# EasyEDA Pro project SCH.epro

# Schematic SCH_1
Board Name: Board1_1; Create Date: 2024-10-25; Page Name: P1; Project Name: 模拟试题; Schematic Name: SCH_1; Update Date: 2024-10-25; Company: 嘉立创EDA; Page Size: A4; Version: V1.0
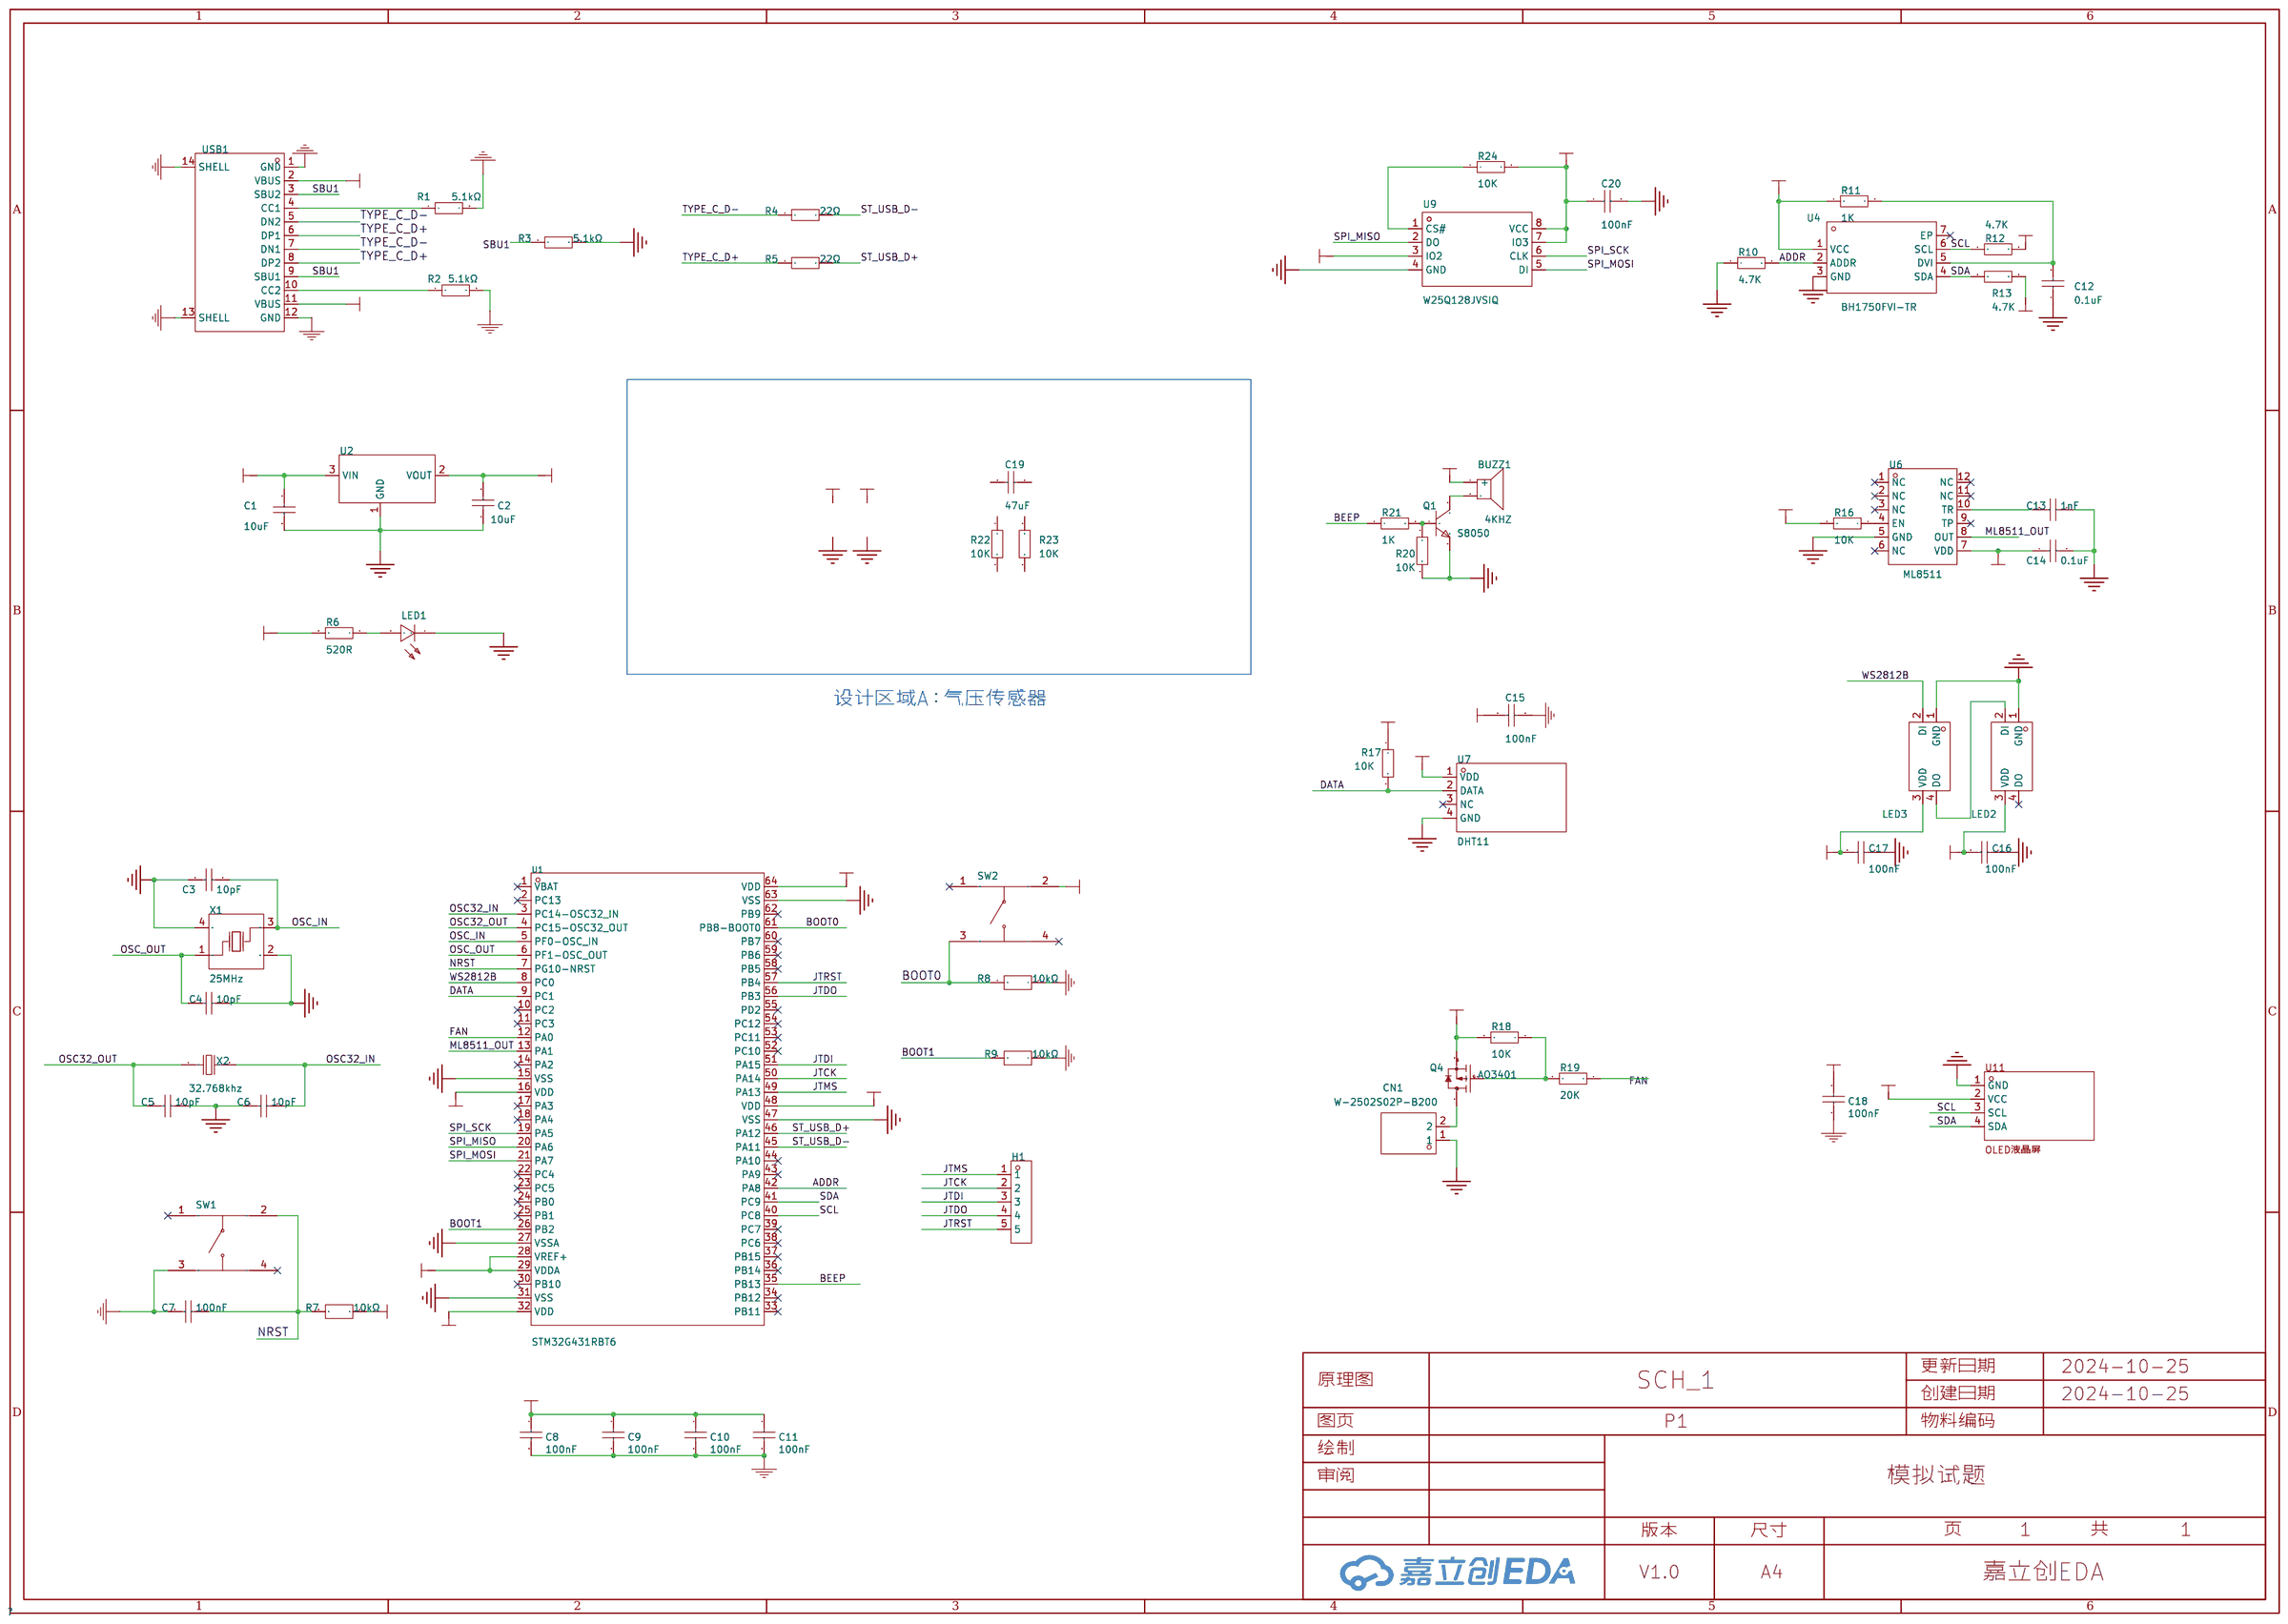
[diagram p0: schematic sheet]

## Parts
BUZZ1  4KHZ  [BUZ-TH_BD12.0-P7.60-D0.6-FD]
C1  10uF  [C0805]
C2  10uF  [C0805]
C3  10pF  [C0805]
C4  10pF  [C0805]
C5  10pF  [C0805]
C6  10pF  [C0805]
C7  100nF  [C0603]
C8  100nF  [C0603]
C9  100nF  [C0603]
C10  100nF  [C0603]
C11  100nF  [C0603]
C12  0.1uF  [C0805]
C13  1nF  [C0805]
C14  0.1uF  [C0805]
C15  100nF  [C0603]
C16  100nF  [C0805]
C17  100nF  [C0805]
C18  100nF  [C0603]
C19  47uF  [C0805]
C20  100nF  [C0603]
CN1  W-2502S02P-B200  [CONN-TH_2P-P2.54_2501S-2P]
H1  -  [5P排针]
LED1  NCD0603R1  [LED0603-RD_RED]
LED2  XL-5050RGBC-WS2812B  [LED-SMD_4P-L5.0-W5.0-BL_XL-5050RGBC]
LED3  XL-5050RGBC-WS2812B  [LED-SMD_4P-L5.0-W5.0-BL_XL-5050RGBC]
Q1  S8050  [SOT-23-3_L2.9-W1.3-P1.90-LS2.3-BR]
Q4  AO3401  [SOT-23-3_L2.9-W1.3-P1.90-LS2.4-BR]
R1  5.1kΩ  [R0603]
R2  5.1kΩ  [R0603]
R3  5.1kΩ  [R0603]
R4  22Ω  [R0603]
R5  22Ω  [R0603]
R6  520R  [R0402]
R7  10kΩ  [R0603]
R8  10kΩ  [R0603]
R9  10kΩ  [R0603]
R10  4.7K  [R0805]
R11  1K  [R0805]
R12  4.7K  [R0805]
R13  4.7K  [R0805]
R16  10K  [R0402]
R17  10K  [R0805]
R18  10K  [R0603]
R19  20K  [R0603]
R20  10K  [R0805]
R21  1K  [R0805]
R22  10K  [R0805]
R23  10K  [R0805]
R24  10K  [R0805]
SW1  TSA017A2540A07  [SW-SMD_4P-L4.2-W3.4-P2.15-LS5.2]
SW2  TSA017A2540A07  [SW-SMD_4P-L4.2-W3.4-P2.15-LS5.2]
U1  STM32G431RBT6  [LQFP-64_L10.0-W10.0-P0.50-LS12.0-BL]
U2  AMS1117-3.3(XBLW)  [SOT-223-3_L6.5-W3.4-P2.30-LS7.0-BR-1]
U4  BH1750FVI-TR  [WSOF-6_L2.6-W1.6-P0.50-TL-EP]
U6  ML8511  [DFN-12_L4.0-W3.7-P1.00-TL]
U7  DHT11  [SENSOR-TH_DHT11]
U8  -  [CONN-TH_4P-P2.54_POGO-4P]
U9  W25Q128JVSIQ  [SOIC-8_L5.3-W5.3-P1.27-LS8.0-BL]
USB1  TYPE-C 16PIN 2MD(073)  [USB-C-SMD_TYPE-C-6PIN-2MD-073]
X1  25MHz  [OSC-SMD_4P-L3.2-W2.5-BL]
X2  32.768kHz  [FC-135R_L3.2-W1.5]

## Library data of the parts
BUZZ1 = TMB12A05_C96093: 驱动方式:有源(内含驱动线路);构造类型:电磁式;频率:2.7kHz;声压(SPL):85dB;; LCSC Part Name: TMB12A05; Supplier Part: C96093; Manufacturer: 华能; Manufacturer Part: TMB12A05; Supplier Footprint: 插件,D=12mm; JLCPCB Part Class: Extended Part; Datasheet: https://atta.szlcsc.com/upload/public/pdf/source/20230426/A4FC10532558AA232D532AB83455FBA4.pdf; Supplier: LCSC; Oscillator Circuit: 有源(内含驱动线路); Technology Type: 电磁式; Operating Voltage: 4V~8V; Sound Pressure Level (SPL): 85dB; Diameter (φD): 12mm; Height: 9.8mm
C1-C6 C12-C14 C16 C17 C19 = CC0805KRX7R9BB104: 容值:100nF;精度:±10%;额定电压:50V;材质(温度系数):X7R;; LCSC Part Name: 100nF ±10% 50V; Supplier Part: C49678; Manufacturer: YAGEO(国巨); Supplier Footprint: 0805; JLCPCB Part Class: 基础库; Datasheet: https://atta.szlcsc.com/upload/public/pdf/source/20180224/C181747_15194369449651363981.pdf; Supplier: LCSC; Tolerance: ±10%; Voltage Rated: 50V; Temperature Coefficient: X7R
C7-C11 C15 C18 C20 = CC0603KRX7R9BB104: 容值:100nF;精度:±10%;额定电压:50V;材质(温度系数):X7R;; LCSC Part Name: 100nF ±10% 50V; Supplier Part: C14663; Manufacturer: YAGEO(国巨); Supplier Footprint: 0603; JLCPCB Part Class: Basic Part; Datasheet: https://atta.szlcsc.com/upload/public/pdf/source/20180910/C282072_33301C7F631E79921B82A8DAC6BCC5B3.pdf; Supplier: LCSC; Tolerance: ±10%; Voltage Rated: 50V; Temperature Coefficient: X7R
CN1 = W-2502S02P-B200: 插针结构:1x2P;间距:2.5mm;安装方式:-;参考系列:XH;总PIN数:2P;排数:1;每排PIN数:2;行距:-;触头材质:黄铜;; LCSC Part Name: 系列:XH 间距:2.5mm 1x2P; Supplier Part: C132463; Manufacturer: Ckmtw(灿科盟); Supplier Footprint: 插件,P=2.5mm; JLCPCB Part Class: Extended Part; Datasheet: https://atta.szlcsc.com/upload/public/pdf/source/20180112/C169006_15157258886881261764.pdf; Supplier: LCSC; Pins Structure: 1x2P; Pitch: 2.5mm; Reference Series: XH; Number of Pins: 2P; Number of Rows: 1; Number of PINs Per Row: 2; Contact Material: 黄铜
H1 = 5P排针: Supplier: LCSC; Supplier Part: C168673; Manufacturer: Amphenol ICC; Manufacturer Part: 68000-102HLF; _: 3
LED1 = NCD0603R1_C84263: 灯头类型:-;发光颜色:红色;正向电压(VF):1.6V~2.6V;功率:65mW;正向电流:20mA;主波长:615nm~630nm;二极管配置:独立二极管;透镜颜色:无色透明透镜;色温:-;发光强度:80mcd~220mcd;发光角度:130°;载带方式:-;工作温度:-30℃~+85℃;; Supplier Part: C84263; Manufacturer: 国星光电; Supplier Footprint: 0603; JLCPCB Part Class: Extended Part; Datasheet: https://atta.szlcsc.com/upload/public/pdf/source/20200820/C84263_DABC6A75E58F576973B407FDBA283D60.pdf; Supplier: LCSC; Emitted Color: 红色; Forward Voltage (VF): 1.6V~2.6V; Power Dissipation: 65mW; Forward Current: 20mA; Dominant Wavelength: 615nm~630nm; Diode Configuration: 独立二极管; Lens Color: 无色透明透镜; Luminous Intensity: 80mcd~220mcd; Viewing Angle: 130°; Operating Temperature: -30℃~+85℃
LED2 LED3 = XL-5050RGBC-WS2812B: 5050七彩幻彩透明贴片LED灯珠 5050 幻彩透明四脚 ws2812B 内置驱动IC; Supplier Part: C2843785; Manufacturer: XINGLIGHT(成兴光); Supplier Footprint: SMD5050; JLCPCB Part Class: Extended Part; Datasheet: https://atta.szlcsc.com/upload/public/pdf/source/20240412/E1004CAA80592E31D08BFE019083806F.pdf; Supplier: LCSC; Emitted Color: RGB三色; Diode Configuration: 共阳极; Dominant Wavelength: 618nm~623nm；520nm~525nm；467nm~472nm; Peak Wavelength: 525nm；623nm；472nm; Forward Current: 20mA; Forward Voltage (VF): 3.4V；3.4V；2.4V; Luminous Intensity: 143mcd；240mcd；845mcd; Power Dissipation: 50mW；50mW；45mW; Viewing Angle: 120°; Mounting Sytle: 正贴; Operating Temperature: -25℃~+80℃
Q1 = S8050_C20069125: 晶体管类型:NPN;集电极电流(Ic):500mA;集射极击穿电压(Vceo):25V;功率(Pd):300mW;直流电流增益(hFE@Ic,Vce):120@50mA,1.0V;; LCSC Part Name: NPN 电流:500mA 耐压:25V; Supplier Part: C20069125; Manufacturer: 宏迦橙; Supplier Footprint: SOT-23; JLCPCB Part Class: Extended Part; Datasheet: https://atta.szlcsc.com/upload/public/pdf/source/20240403/2D78449C96B6E27F13BF8BDF79E27159.pdf; Supplier: LCSC; Transistor Type: NPN; Collector Current (Ic): 500mA; Collector-Emitter Breakdown Voltage (Vceo): 25V; Power Dissipation (Pd): 300mW; DC Current Gain (hFE@Ic,Vce): 120@50mA,1.0V; Transition Frequency (fT): 100MHz; Collector Cut-Off Current (Icbo): 100nA; Collector-Emitter Saturation Voltage (VCE(sat)@Ic,Ib): 600mV@500mA,50mA; Operating Temperature: -55℃~+150℃
Q4 = AO3401_C181091: 类型:1个P沟道;漏源电压(Vdss):30V;连续漏极电流(Id):4.2A;功率(Pd):350mW;导通电阻(RDS(on)@Vgs,Id):65mΩ@10V,4.2A;阈值电压(Vgs(th)@Id):1.3V@250uA;; LCSC Part Name: 1个P沟道 耐压:30V 电流:4.2A; Supplier Part: C181091; Manufacturer: Hottech(合科泰); Supplier Footprint: SOT-23; JLCPCB Part Class: 扩展库; Datasheet: https://atta.szlcsc.com/upload/public/pdf/source/20180131/C181091_15173931948391329220.pdf; Supplier: LCSC; Type: 1个P沟道; Drain Source Voltage (Vdss): 30V; Continuous Drain Current (Id): 4.2A; Power Dissipation (Pd): 350mW; Drain Source On Resistance (RDS(on)@Vgs,Id): 65mΩ@10V,4.2A; Gate Threshold Voltage (Vgs(th)@Id): 1.3V@250uA
R1-R3 = 0603WAF5101T5E: 电阻类型:厚膜电阻;阻值:5.1kΩ;精度:±1%;功率:100mW;最大工作电压:75V;温度系数:±100ppm/℃;; LCSC Part Name: 5.1kΩ ±1% 100mW 厚膜电阻; Supplier Part: C23186; Manufacturer: UNI-ROYAL(厚声); Supplier Footprint: 0603; JLCPCB Part Class: Basic Part; Datasheet: https://atta.szlcsc.com/upload/public/pdf/source/20200306/C422600_1E6D84923E4A46A82E41ADD87F860B5C.pdf; Supplier: LCSC; Type: 厚膜电阻; Tolerance: ±1%; Power(Watts): 100mW; Overload Voltage (Max): 75V; Temperature Coefficient: ±100ppm/℃; Operating Temperature Range: -55℃~+155℃
R4 R5 = 0603WAF220JT5E: 电阻类型:厚膜电阻;阻值:22Ω;精度:±1%;功率:100mW;最大工作电压:75V;温度系数:±100ppm/℃;; LCSC Part Name: 22Ω ±1% 100mW 厚膜电阻; Supplier Part: C23345; Manufacturer: UNI-ROYAL(厚声); Supplier Footprint: 0603; JLCPCB Part Class: Basic Part; Datasheet: https://atta.szlcsc.com/upload/public/pdf/source/20200306/C422600_1E6D84923E4A46A82E41ADD87F860B5C.pdf; Supplier: LCSC; Type: 厚膜电阻; Tolerance: ±1%; Power(Watts): 100mW; Overload Voltage (Max): 75V; Temperature Coefficient: ±100ppm/℃; Operating Temperature Range: -55℃~+155℃
R6 R16 = RC0402FR-0710KL: 电阻类型:厚膜电阻;阻值:10kΩ;精度:±1%;功率:62.5mW;; LCSC Part Name: 10kΩ ±1% 62.5mW; Supplier Part: C60490; Manufacturer: YAGEO(国巨); Supplier Footprint: 0402; JLCPCB Part Class: Extended Part; Datasheet: https://atta.szlcsc.com/upload/public/pdf/source/20170606/1496716515432.pdf; Supplier: LCSC; Type: 厚膜电阻; Tolerance: ±1%; Power(Watts): 62.5mW; Temperature Coefficient: ±100ppm/℃; Overload Voltage (Max): 50V; Operating Temperature Range: -55℃~+155℃
R7-R9 = 0603WAF1002T5E: 电阻类型:厚膜电阻;阻值:10kΩ;精度:±1%;功率:100mW;最大工作电压:75V;温度系数:±100ppm/℃;; LCSC Part Name: 厚膜电阻 10kΩ ±1% 100mW; Supplier Part: C25804; Manufacturer: UNI-ROYAL(厚声); Supplier Footprint: 0603; JLCPCB Part Class: Basic Part; Datasheet: https://atta.szlcsc.com/upload/public/pdf/source/20200306/C422600_1E6D84923E4A46A82E41ADD87F860B5C.pdf; Supplier: LCSC; Type: 厚膜电阻; Tolerance: ±1%; Power(Watts): 100mW; Overload Voltage (Max): 75V; Temperature Coefficient: ±100ppm/℃; Operating Temperature Range: -55℃~+155℃
R10-R13 R17 R20-R24 = Res_0805: Supplier Footprint: 0805
R18 R19 = Res_0603: Supplier Footprint: 0603
SW1 SW2 = TSA017A2540A07: 按钮形状:椭圆形按钮;作用力:400gf;安装方式:立贴;开关长度:4.2mm;开关宽度:3.35mm;开关高度:2.5mm;触点电流:50mA;额定电压(AC):-;额定电压(DC):12V;机械寿命:-;; LCSC Part Name: 4.2*3.35*2.5mm 立贴 轻触开关; Supplier Part: C2888434; Manufacturer: BZCN(博众电气); Supplier Footprint: SMD; JLCPCB Part Class: 扩展库; Datasheet: https://atta.szlcsc.com/upload/public/pdf/source/20210906/F29F74F1A6DE5E6C38338EAD973C3529.pdf; Supplier: LCSC; Actuator Style: 椭圆形按钮; Operating Force: 400gf; Mounting Style: 立贴; Switch Length: 4.2mm; Switch Width: 3.35mm; Switch Height: 2.5mm; Contact Current: 50mA; Voltage Rating (DC): 12V; Actuator/Cap Color: 白色
U1 = STM32G431RBT6: CPU内核:ARM-M系列;程序存储容量:128KB;GPIO端口数量:52;工作电压范围:1.71V~3.6V;CPU最大主频:170MHz;; Supplier Part: C431633; Manufacturer: ST(意法半导体); Supplier Footprint: LQFP-64(10x10); JLCPCB Part Class: 扩展库; Datasheet: https://atta.szlcsc.com/upload/public/pdf/source/20190925/C431633_8068E60CC825A086DCCD86A4BDED9458.pdf; Supplier: LCSC; CPU Core: ARM-M系列; Program Storage Size: 128KB; GPIO Ports Number: 52; Operating Voltage Range: 1.71V~3.6V; CPU Maximum Speed: 170MHz; Operating Temperature Range: -40℃~+85℃; ADC (Bit): 12bit; DAC (Bit): 12bit; Watchdog: 有; Infrared Data Association: 有; Low-Voltage Detect: 有; Direct Memory Access: 有; Internal Oscillator: 有
U2 = AMS1117-3.3(XBLW)_C18906017: 最大输入电压:15V;输出电压:3.3V;最大输出电流:1A;电源纹波抑制比(PSRR):60dB;; Supplier Part: C18906017; Manufacturer: XBLW(芯伯乐); Supplier Footprint: SOT-223; JLCPCB Part Class: 扩展库; Datasheet: https://atta.szlcsc.com/upload/public/pdf/source/20231019/F4230EEFC48908FC91962BB59ACA9AD6.pdf; Supplier: LCSC; Maximum Input Voltage: 15V; Output Voltage: 3.3V; MAX Output Current: 1A; Power Supply Rejection Ratio (PSRR): 60dB; standby current: 4mA; Operating Temperature: -40℃~+125℃; Number of Outputs: 1
U4 = BH1750FVI-TR: 检测颜色:-;接口类型:I2C;分辨率(位):16;; Supplier Part: C78960; Manufacturer: ROHM(罗姆); Supplier Footprint: WSOF-6; Datasheet: https://atta.szlcsc.com/upload/public/pdf/source/20160723/1469258984787.pdf; Supplier: LCSC; Interface Type: I2C; Supply Voltage: 2.4V~3.6V; Resolution: 16; Operating Temperature: -40℃~+85℃
U6 = ML8511_REFBOARD: Supplier Part: C19501581; Manufacturer: ROHM(罗姆); JLCPCB Part Class: 扩展库; Datasheet: https://atta.szlcsc.com/upload/public/pdf/source/20231221/86F2DBEAA739866045DC95770D30AEE3.pdf; Supplier: LCSC
U7 = DHT11: 新款电容式数字温湿度传感器,老款已停产16.1x12.6x5.8mm; Supplier: LCSC; Supplier Part: C117051; Manufacturer: 广州奥松; LCSC Part Name: DHT11  电容式传感器; Supplier Footprint: SIP-4; Datasheet: https://atta.szlcsc.com/upload/public/pdf/source/20170703/1499081238365.pdf
U8 = OLED液晶屏
U9 = W25Q128JVSIQ: 存储器构架(格式):FLASH;存储器接口类型:SPI - Dual/Quad I/O;存储器容量:128Mb (16M x 8);; Supplier Part: C97521; Manufacturer: WINBOND(华邦); Supplier Footprint: SOIC-8_208mil; JLCPCB Part Class: Basic Part; Datasheet: https://atta.szlcsc.com/upload/public/pdf/source/20170316/1489627409956.pdf; Supplier: LCSC; Memory Format: FLASH; Memory Interface: SPI - Dual/Quad I/O; Memory Size: 128Mb (16M x 8); Voltage - Supply: 2.7V ~ 3.6V
USB1 = TYPE-C 16PIN 2MD(073): 连接器类型:Type-C;标准:-;公母:母;端口数量:1;触点数量:16P;安装方式:卧贴;额定电流 - 电源:5A;工作温度范围:-25℃~+85℃;; LCSC Part Name: Type-C 母 卧贴; Supplier Part: C2765186; Manufacturer: SHOU HAN(首韩); Supplier Footprint: SMD; JLCPCB Part Class: Extended Part; Datasheet: https://atta.szlcsc.com/upload/public/pdf/source/20211123/39B17C16241EAC15C5E277BDA434118E.pdf; Supplier: LCSC; Connector Type: Type-C; Gender: 母; Number of Ports: 1; Number of Contacts: 16P; Mounting Style: 卧贴; Current Rating - Power (Max): 5A; Operating Temperature Range: -25℃~+85℃
X1 = X322525MOB4SI: 晶振类型:贴片晶振;频率:25MHz;常温频差:±10ppm;外接负载电容:12pF;频率稳定度(全温):±20ppm;; LCSC Part Name: 25MHz ±10ppm 12pF; Supplier Part: C9006; Manufacturer: YXC(扬兴晶振); Supplier Footprint: SMD3225-4P; JLCPCB Part Class: 基础库; Datasheet: https://atta.szlcsc.com/upload/public/pdf/source/20240329/19D5F850207469550BEB00D7DFEDBC7A.pdf; Supplier: LCSC; Crystal Type: 贴片晶振; Normal temperature Frequency Tolerance: ±10ppm; External load capacitor: 12pF; Frequency Stability(Full temperature range): ±20ppm; Operating Temperature: -40℃~+85℃
X2 = Q13FC1350000400: 频率:32.768kHz;晶振类型:贴片无源晶振;负载电容:12.5pF;等效串联电阻(ESR):70kΩ;频率公差:±20ppm;频率稳定度:-;工作温度:-40℃~+85℃;; LCSC Part Name: FC-135  32.768KHz ±20ppm 12.5pF; Supplier Part: C32346; Manufacturer: EPSON(爱普生); LCSC On Sale: 1; Supplier Footprint: SMD3215-2P; Price: 3.35; JLCPCB On Sale: 1; Datasheet: https://atta.szlcsc.com/upload/public/pdf/source/20190108/C32346_746D6B07EAF90824457A96480007685F.pdf; Supplier: LCSC; Operating Temperature: -40℃~+85℃; Crystal Type: 贴片无源晶振; Load Capacitance: 12.5pF; Equivalent Series Resistance (ESR): 70kΩ; Frequency Tolerance: ±20ppm

## Nets
3.3V: BUZZ1.1(+) C2.2 C8.1 C9.1 C10.1 C11.1 C14.1 C15.1 C18.1 C20.1 R6.2 R7.1 R11.1 R12.2 R13.2 R16.2 R17.1 R24.2 SW2.2 U1.16(VDD) U1.28(VREF+) U1.29(VDDA) U1.32(VDD) U1.48(VDD) U1.64(VDD) U2.2(VOUT) U4.1(VCC) U6.7(VDD) U7.1(VDD) U8.2(VCC) U9.3(IO2) U9.7(IO3) U9.8(VCC)
5V: C1.1 C16.2 C17.2 LED2.3(VDD) LED3.3(VDD) Q4.2(S) R18.2 U2.3(VIN) USB1.2(VBUS) USB1.11(VBUS)
GND: C1.2 C2.1 C3.1 C4.1 C5.1 C6.2 C7.2 C8.2 C9.2 C10.2 C11.2 C12.1 C13.1 C14.2 C15.2 C16.1 C17.1 C18.2 C20.2 CN1.1 LED1.1(K) LED2.1(GND) LED3.1(GND) Q1.2 R1.2 R2.2 R3.2 R8.1 R9.1 R10.1 R20.2 SW1.3 U1.15(VSS) U1.27(VSSA) U1.31(VSS) U1.47(VSS) U1.63(VSS) U2.1(GND) U4.3(GND) U6.5(GND) U7.4(GND) U8.1(GND) U9.4(GND) USB1.1(GND) USB1.12(GND) USB1.13(SHELL) USB1.14(SHELL) X1.2(GND) X1.4(GND)
ADDR: R10.2 U1.42(PA8) U4.2(ADDR)
BEEP: R21.1 U1.35(PB13)
BOOT0: R8.2 SW2.3 U1.61(PB8-BOOT0)
BOOT1: R9.2 U1.26(PB2)
DATA: R17.2 U1.9(PC1) U7.2(DATA)
FAN: R19.1 U1.12(PA0)
JTCK: H1.2 U1.50(PA14)
JTDI: H1.3 U1.51(PA15)
JTDO: H1.4 U1.56(PB3)
JTMS: H1.1 U1.49(PA13)
JTRST: H1.5 U1.57(PB4)
ML8511_OUT: U1.13(PA1) U6.8(OUT)
NRST: C7.1 R7.2 SW1.2 U1.7(PG10-NRST)
OSC32_IN: C6.1 U1.3(PC14-OSC32_IN) X2.2
OSC32_OUT: C5.2 U1.4(PC15-OSC32_OUT) X2.1
OSC_IN: C3.2 U1.5(PF0-OSC_IN) X1.3(OSC2)
OSC_OUT: C4.2 U1.6(PF1-OSC_OUT) X1.1(OSC1)
SBU1: R3.1 USB1.3(SBU2) USB1.9(SBU1)
SCL: R12.1 U1.40(PC8) U4.6(SCL) U8.3(SCL)
SDA: R13.1 U1.41(PC9) U4.4(SDA) U8.4(SDA)
SPI_MISO: U1.20(PA6) U9.2(DO)
SPI_MOSI: U1.21(PA7) U9.5(DI)
SPI_SCK: U1.19(PA5) U9.6(CLK)
ST_USB_D+: R5.2 U1.46(PA12)
ST_USB_D-: R4.2 U1.45(PA11)
TYPE_C_D+: R5.1 USB1.6(DP1) USB1.8(DP2)
TYPE_C_D-: R4.1 USB1.5(DN2) USB1.7(DN1)
WS2812B: LED3.2(DI) U1.8(PC0)
Net-(BUZZ1-2): BUZZ1.2 Q1.3
Net-(C12-2): C12.2 R11.2 U4.5(DVI)
Net-(C13-2): C13.2 U6.10(TR)
Net-(CN1-2): CN1.2 Q4.3(D)
Net-(LED1-2): LED1.2(A) R6.1
Net-(LED2-2): LED2.2(DI) LED3.4(DO)
Net-(Q1-1): Q1.1 R20.1 R21.2
Net-(Q4-1): Q4.1(G) R18.1 R19.2
Net-(R1-1): R1.1 USB1.4(CC1)
Net-(R2-1): R2.1 USB1.10(CC2)
Net-(R16-1): R16.1 U6.4(EN)
Net-(R24-1): R24.1 U9.1(CS#)

Not connected (* = marked no-connect by the designer): C19 1 2; LED2 4(DO)*; R22 1 2; R23 1 2; SW1 1* 4*; SW2 1* 4*; U1 1(VBAT)* 2(PC13)* 10(PC2)* 11(PC3)* 14(PA2)* 17(PA3)* 18(PA4)* 22(PC4)* 23(PC5)* 24(PB0)* 25(PB1)* 30(PB10)* 33(PB11)* 34(PB12)* 36(PB14)* 37(PB15)* 38(PC6)* 39(PC7)* 43(PA9)* 44(PA10)* 52(PC10)* 53(PC11)* 54(PC12)* 55(PD2)* 58(PB5)* 59(PB6)* 60(PB7)* 62(PB9)*; U4 7(EP)*; U6 1(NC)* 2(NC)* 3(NC)* 6(NC)* 9(TP)* 11(NC)* 12(NC)*; U7 3(NC)*

## Notes on the sheet
- 设计区域A：气压传感器
